# EAGLE design RPi_Extension_adc (EAGLE 8.4.3)
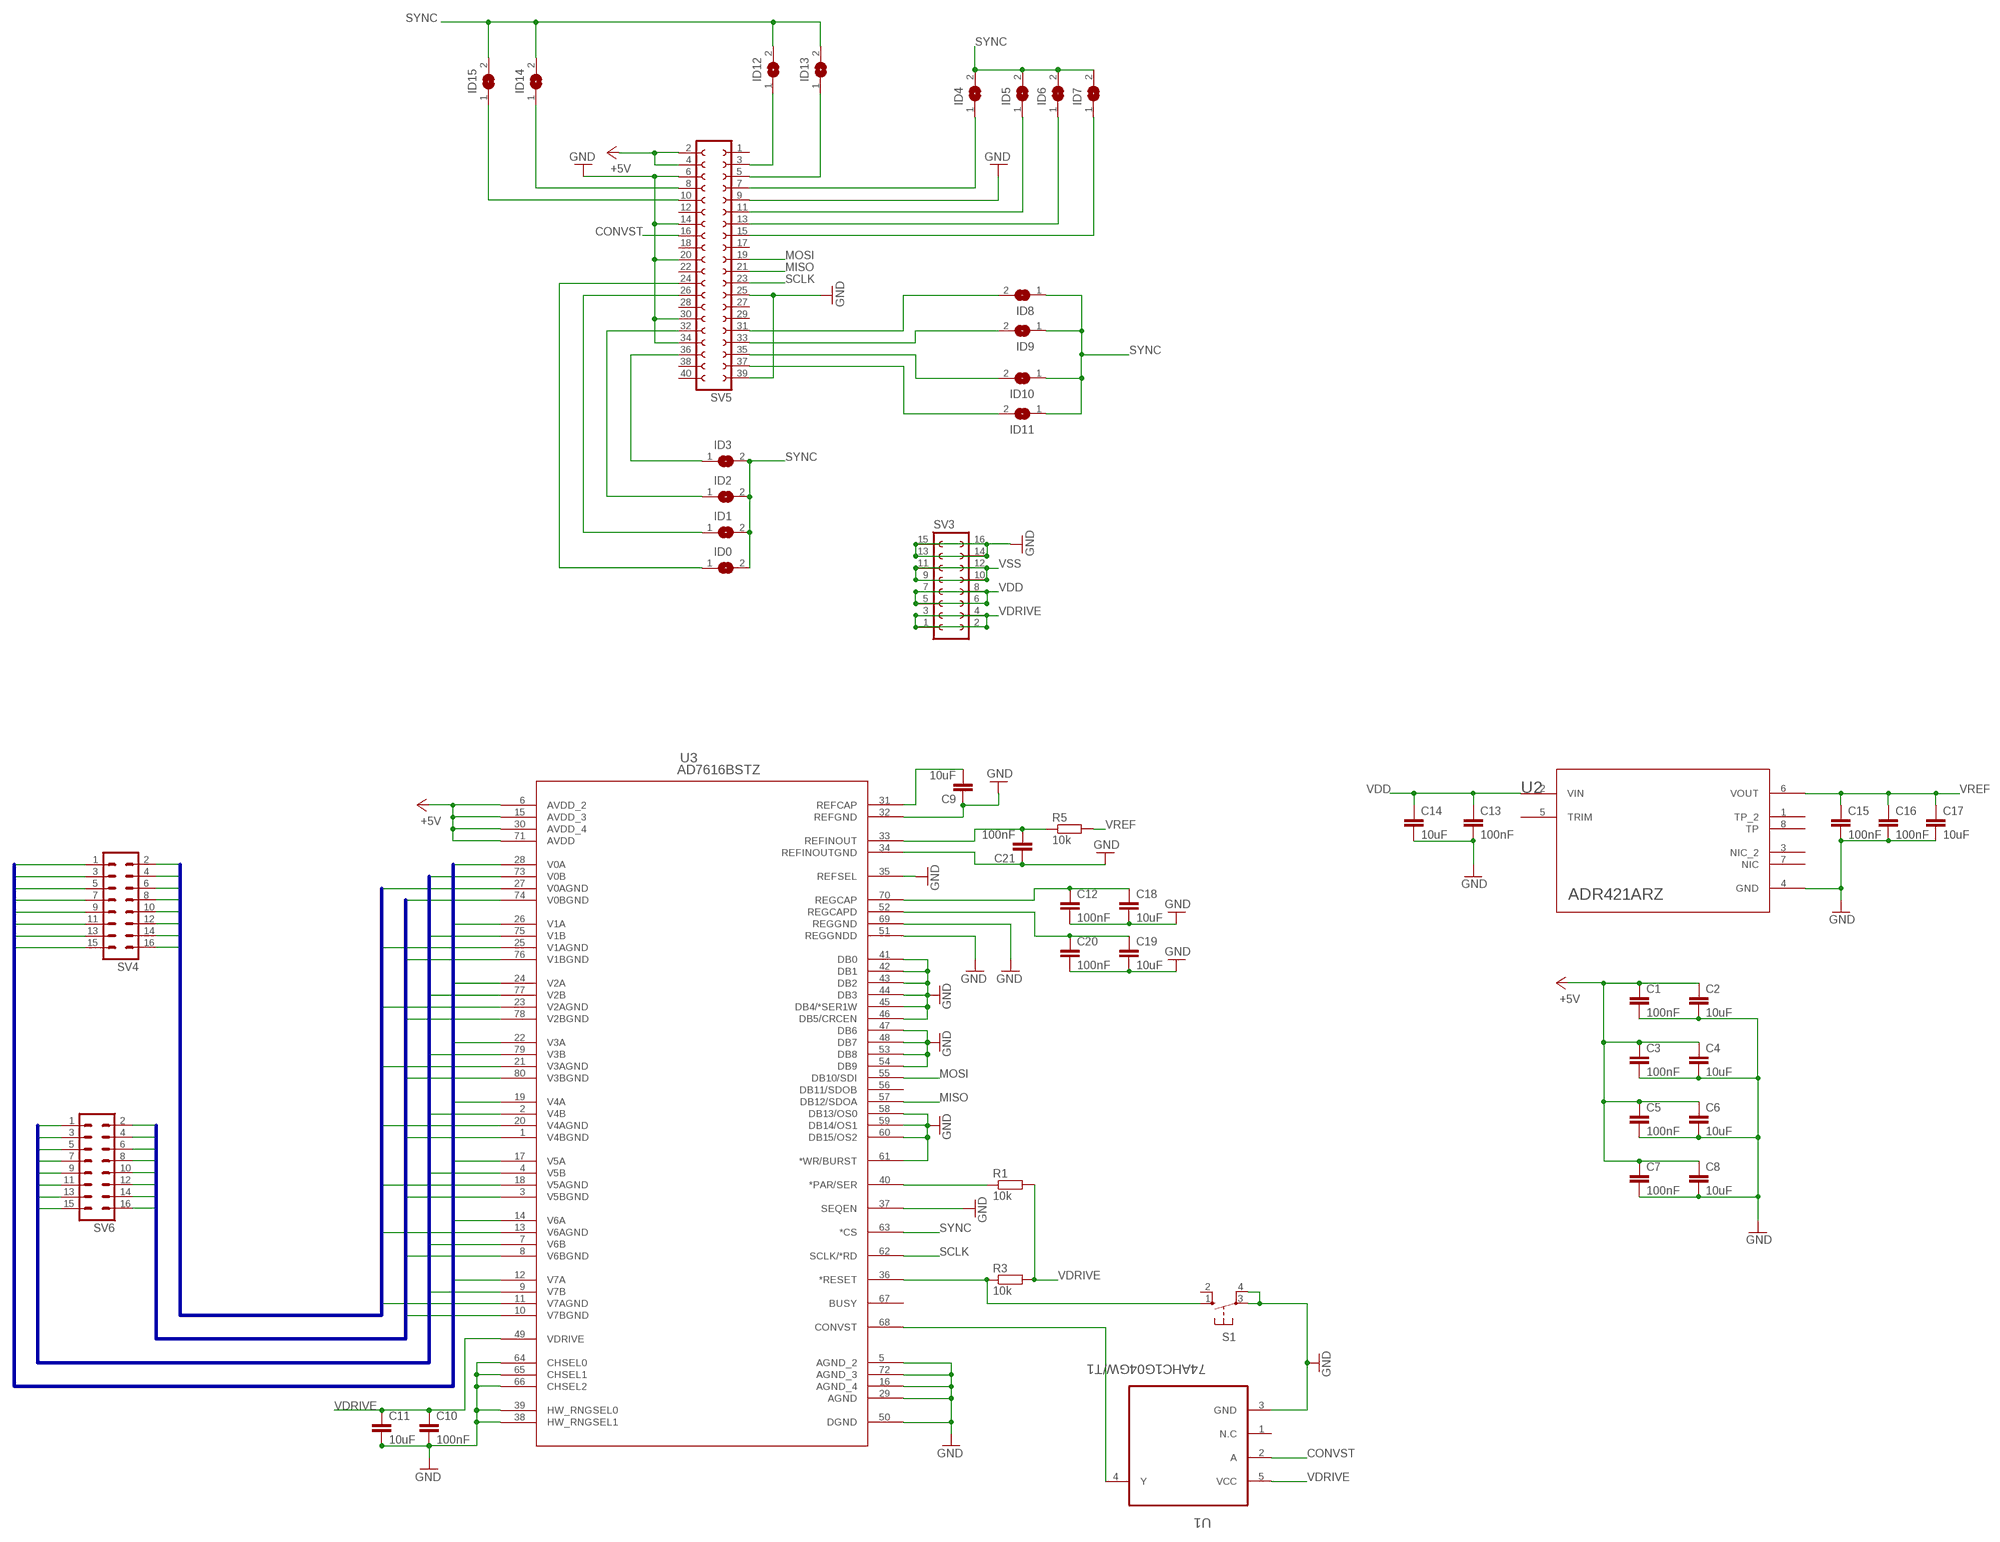
[diagram p0: schematic, sheet 1]

## Parts
C1  100nF  C-EUC0603  [C0603]
C2  10uF  C-EUC0603  [C0603]
C3  100nF  C-EUC0603  [C0603]
C4  10uF  C-EUC0603  [C0603]
C5  100nF  C-EUC0603  [C0603]
C6  10uF  C-EUC0603  [C0603]
C7  100nF  C-EUC0603  [C0603]
C8  10uF  C-EUC0603  [C0603]
C9  10uF  C-EUC0603  [C0603]
C10  100nF  C-EUC0603  [C0603]
C11  10uF  C-EUC0603  [C0603]
C12  100nF  C-EUC0603  [C0603]
C13  100nF  C-EUC0603  [C0603]
C14  10uF  C-EUC1206  [C1206]
C15  100nF  C-EUC0603  [C0603]
C16  100nF  C-EUC0603  [C0603]
C17  10uF  C-EUC1206  [C1206]
C18  10uF  C-EUC0603  [C0603]
C19  10uF  C-EUC0603  [C0603]
C20  100nF  C-EUC0603  [C0603]
C21  100nF  C-EUC0603  [C0603]
ID0  SJ  [SJ]
ID1  SJ  [SJ]
ID2  SJ  [SJ]
ID3  SJ  [SJ]
ID4  SJ  [SJ]
ID5  SJ  [SJ]
ID6  SJ  [SJ]
ID7  SJ  [SJ]
ID8  SJ  [SJ]
ID9  SJ  [SJ]
ID10  SJ  [SJ]
ID11  SJ  [SJ]
ID12  SJ  [SJ]
ID13  SJ  [SJ]
ID14  SJ  [SJ]
ID15  SJ  [SJ]
R1  10k  R-EU_R0603  [R0603]
R3  10k  R-EU_R0603  [R0603]
R5  10k  R-EU_R0603  [R0603]
S1  10-XX  [B3F-10XX]
SV3  FE08-2  [FE08-2]
SV4  MA08-2W  [MA08-2W]
SV5  FE20-2  [FE20-2]
SV6  MA08-2W  [MA08-2W]
U1  74AHC1G04GW/T1  [SOT65P210X110-5N]
U2  ADR421ARZ  ADR423ARZ  [R_8]
U3  AD7616BSTZ  [ST_80_2]

## Nets
+5V: C1.1 C2.1 C3.1 C4.1 C5.1 C6.1 C7.1 C8.1 SV5.2 SV5.4 U3.6(AVDD_2) U3.15(AVDD_3) U3.30(AVDD_4) U3.71(AVDD)
CONVST: SV5.16 U1.2(A)
GND: C1.2 C2.2 C3.2 C4.2 C5.2 C6.2 C7.2 C8.2 C9.1 C10.2 C11.2 C12.2 C13.2 C14.2 C15.2 C16.2 C17.2 C18.2 C19.2 C20.2 C21.1 S1.3(P) S1.4(P1) SV3.13 SV3.14 SV3.15 SV3.16 SV5.6 SV5.9 SV5.14 SV5.20 SV5.25 SV5.30 SV5.34 SV5.39 U1.3(GND) U2.4(GND) U3.5(AGND_2) U3.16(AGND_4) U3.29(AGND) U3.32(REFGND) U3.34(REFINOUTGND) U3.35(REFSEL) U3.37(SEQEN) U3.38(HW_RNGSEL1) U3.39(HW_RNGSEL0) U3.41(DB0) U3.42(DB1) U3.43(DB2) U3.44(DB3) U3.45(DB4/*SER1W) U3.46(DB5/CRCEN) U3.47(DB6) U3.48(DB7) U3.50(DGND) U3.51(REGGNDD) U3.53(DB8) U3.54(DB9) U3.58(DB13/OS0) U3.59(DB14/OS1) U3.60(DB15/OS2) U3.61(*WR/BURST) U3.64(CHSEL0) U3.65(CHSEL1) U3.66(CHSEL2) U3.69(REGGND) U3.72(AGND_3)
MISO: SV5.21 U3.57(DB12/SDOA)
MOSI: SV5.19 U3.55(DB10/SDI)
N$1: C12.1 C18.1 U3.70(REGCAP)
N$2: C9.2 U3.31(REFCAP)
N$3: U1.4(Y) U3.68(CONVST)
N$5: ID12.1 SV5.3
N$6: R1.1 U3.40(*PAR/SER)
N$7: R3.1 S1.1(S) U3.36(*RESET)
N$8: ID13.1 SV5.5
N$9: ID14.1 SV5.8
N$10: C21.2 R5.1 U3.33(REFINOUT)
N$11: ID15.1 SV5.10
N$12: ID8.2 SV5.31
N$13: ID9.2 SV5.33
N$14: ID10.2 SV5.35
N$15: ID11.2 SV5.37
N$16: C19.1 C20.1 U3.52(REGCAPD)
N$20: ID3.1 SV5.36
N$21: ID4.1 SV5.7
N$22: ID2.1 SV5.32
N$23: ID1.1 SV5.26
N$24: ID0.1 SV5.24
N$25: ID5.1 SV5.11
N$26: ID6.1 SV5.13
N$27: ID7.1 SV5.15
SCLK: SV5.23 U3.62(SCLK/*RD)
SYNC: ID0.2 ID1.2 ID2.2 ID3.2 ID4.2 ID5.2 ID6.2 ID7.2 ID8.1 ID9.1 ID10.1 ID11.1 ID12.2 ID13.2 ID14.2 ID15.2 U3.63(*CS)
VA_GND0: SV4.2 U3.27(V0AGND)
VA_GND1: SV4.4 U3.25(V1AGND)
VA_GND2: SV4.6 U3.23(V2AGND)
VA_GND3: SV4.8 U3.21(V3AGND)
VA_GND4: SV4.10 U3.20(V4AGND)
VA_GND5: SV4.12 U3.18(V5AGND)
VA_GND6: SV4.14 U3.13(V6AGND)
VA_GND7: SV4.16 U3.11(V7AGND)
VA_IN0: SV4.1 U3.28(V0A)
VA_IN1: SV4.3 U3.26(V1A)
VA_IN2: SV4.5 U3.24(V2A)
VA_IN3: SV4.7 U3.22(V3A)
VA_IN4: SV4.9 U3.19(V4A)
VA_IN5: SV4.11 U3.17(V5A)
VA_IN6: SV4.13 U3.14(V6A)
VA_IN7: SV4.15 U3.12(V7A)
VB_GND0: SV6.16 U3.74(V0BGND)
VB_GND1: SV6.14 U3.76(V1BGND)
VB_GND2: SV6.12 U3.78(V2BGND)
VB_GND3: SV6.10 U3.80(V3BGND)
VB_GND4: SV6.8 U3.1(V4BGND)
VB_GND5: SV6.6 U3.3(V5BGND)
VB_GND6: SV6.4 U3.8(V6BGND)
VB_GND7: SV6.2 U3.10(V7BGND)
VB_IN0: SV6.15 U3.73(V0B)
VB_IN1: SV6.13 U3.75(V1B)
VB_IN2: SV6.11 U3.77(V2B)
VB_IN3: SV6.9 U3.79(V3B)
VB_IN4: SV6.7 U3.2(V4B)
VB_IN5: SV6.5 U3.4(V5B)
VB_IN6: SV6.3 U3.7(V6B)
VB_IN7: SV6.1 U3.9(V7B)
VDD: C13.1 C14.1 SV3.5 SV3.6 SV3.7 SV3.8 U2.2(VIN)
VDRIVE: C10.1 C11.1 R1.2 R3.2 SV3.1 SV3.2 SV3.3 SV3.4 U1.5(VCC) U3.49(VDRIVE)
VREF: C15.1 C16.1 C17.1 R5.2 U2.6(VOUT)
VSS: SV3.9 SV3.10 SV3.11 SV3.12
Unconnected: S1.2(S1) SV5.1 SV5.12 SV5.17 SV5.18 SV5.22 SV5.27 SV5.28 SV5.29 SV5.38 SV5.40 U1.1(N.C) U2.1(TP_2) U2.3(NIC_2) U2.5(TRIM) U2.7(NIC) U2.8(TP) U3.56(DB11/SDOB) U3.67(BUSY)

## Buses
VA_GND[0..7]
VA_IN[0..7]
VB_IN[0..7]
VB_GND[0..7]

## Library data of the parts
C1-C21 = rcl:C-EU: CAPACITOR, European symbol
ID0 ID1-ID15 = jumper:SJ: SMD solder JUMPER
R1 R3 R5 = resistor:R-EU_: RESISTOR, European symbol
S1 = switch-omron:10-XX: OMRON SWITCH; MPN: B3F-1000; OC_FARNELL: 176432; OC_NEWARK: 36M3542
SV3 = con-lsta:FE08-2: FEMALE HEADER; OC_FARNELL: unknown; OC_NEWARK: unknown
SV4 SV6 = con-lstb:MA08-2W: PIN HEADER; OC_FARNELL: unknown; OC_NEWARK: unknown
SV5 = con-lsta:FE20-2: FEMALE HEADER; OC_FARNELL: unknown; OC_NEWARK: unknown
U1 = 74AHC1G04GW:74AHC1G04GW/T1: Inverter; MPN: 74AHC1G04GW/T1; OC_FARNELL: 1085239; OC_NEWARK: 99K0513; PACKAGE: SOT353-1-5; SUPPLIER: NXP
U2 = ADR423ARZ:ADR423ARZ; MANUFACTURER_PART_NUMBER: ADR423ARZ; VENDOR: Vendor
U3 = AD7616BSTZ:AD7616BSTZ

## Board
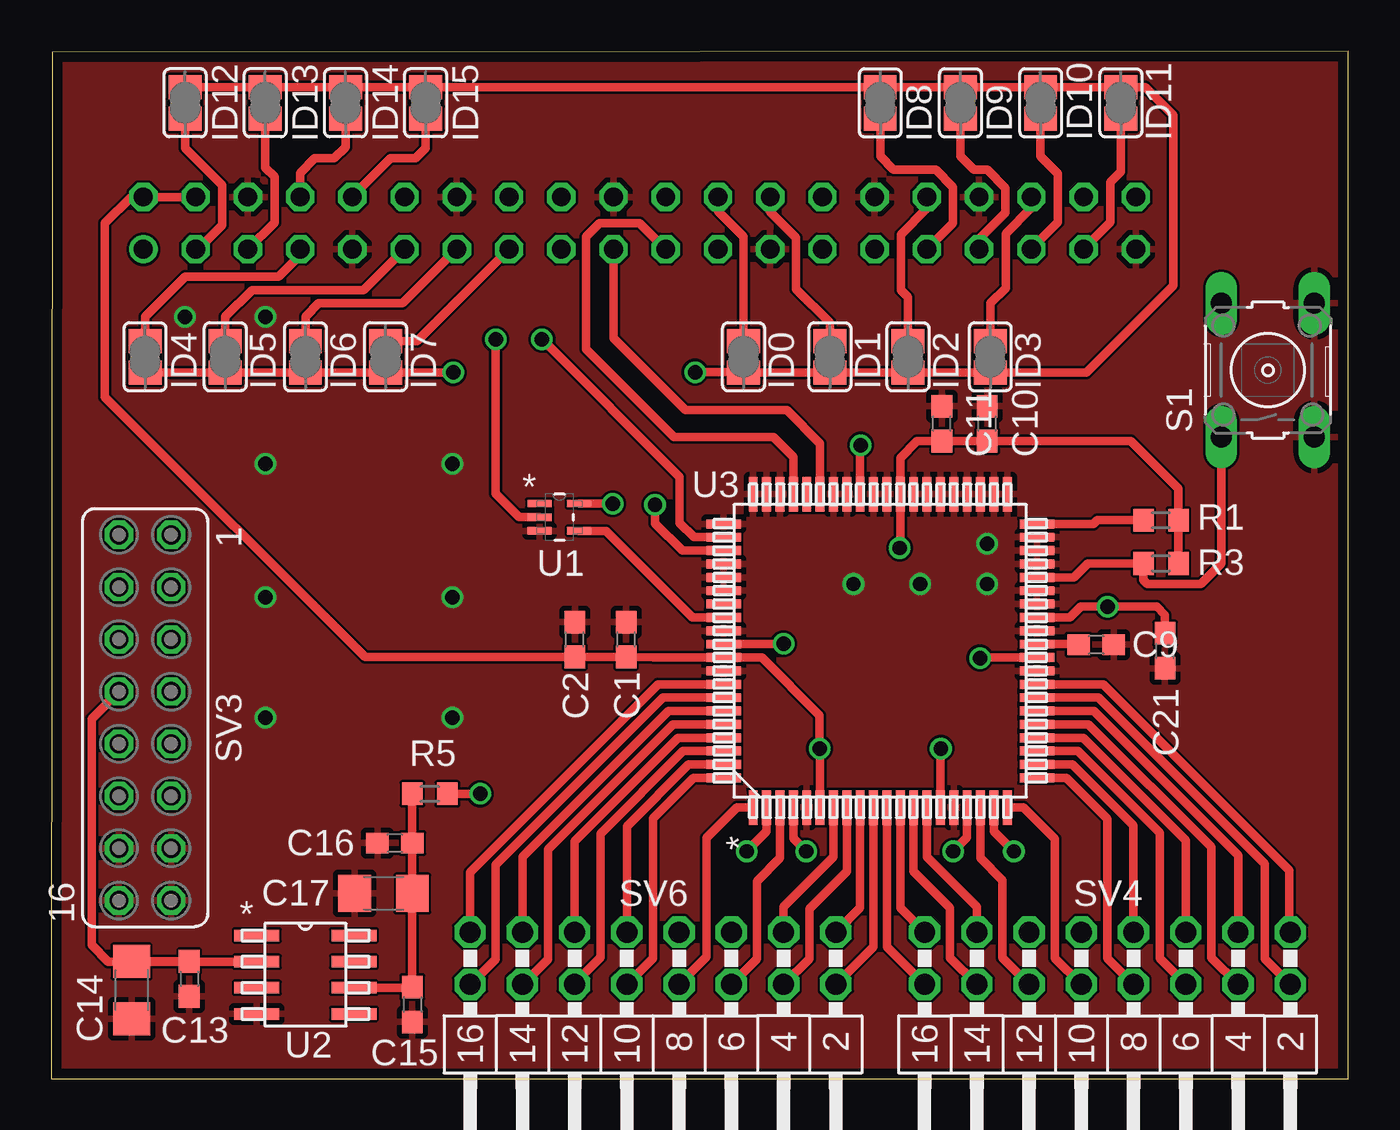
[diagram p1: board, top side]
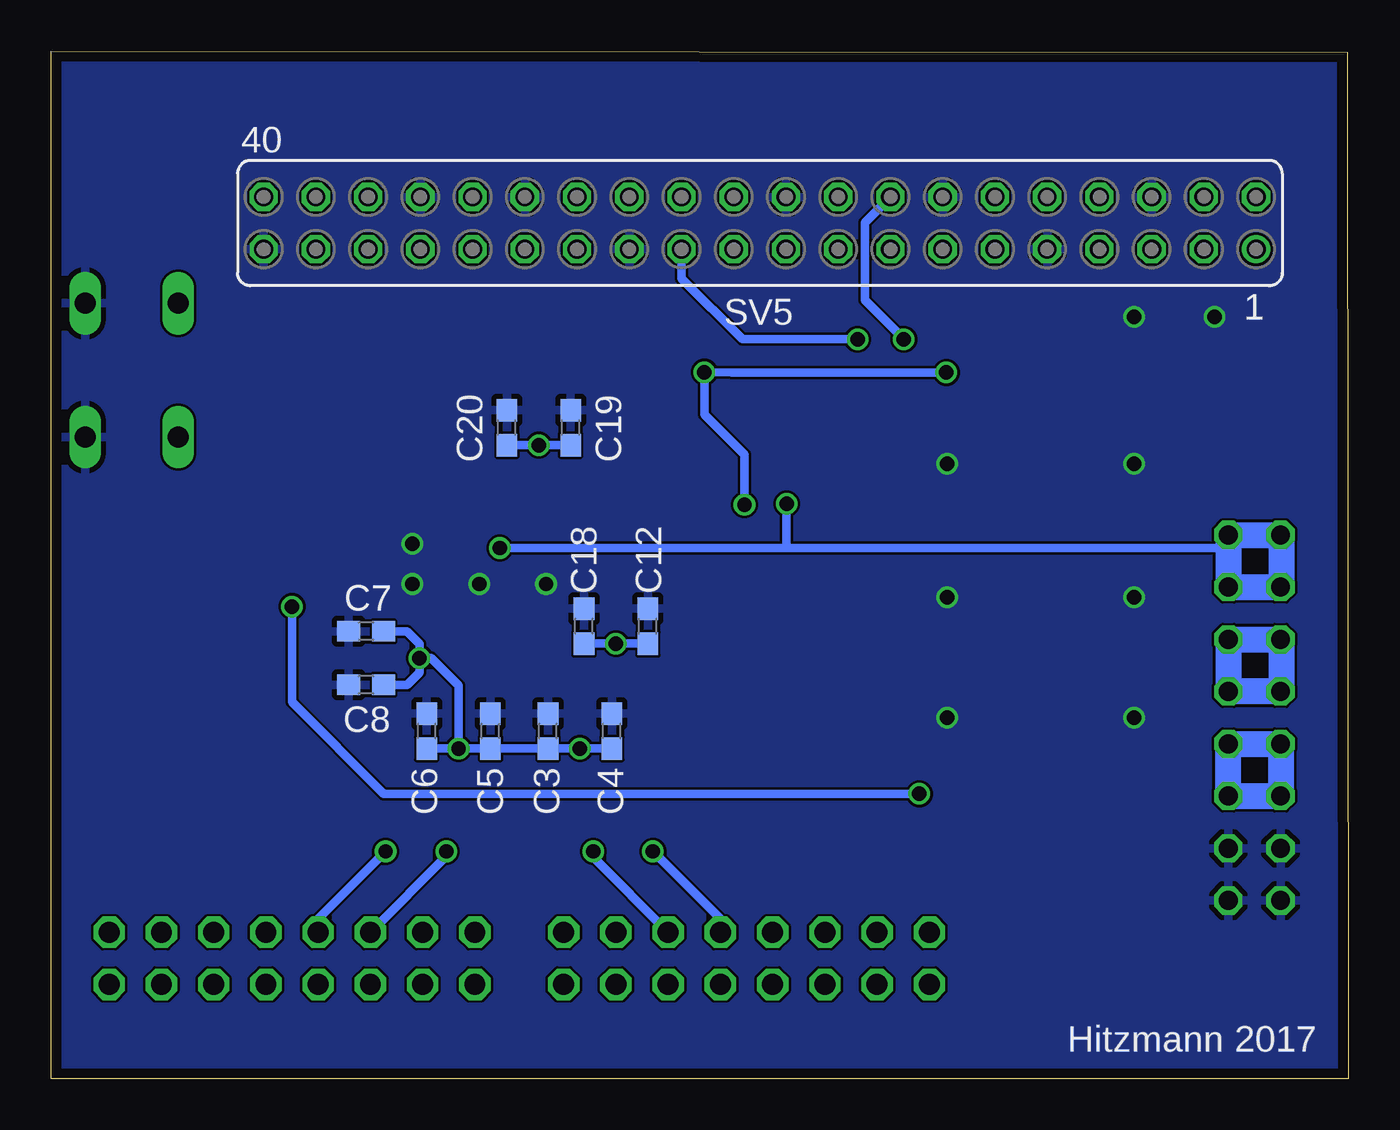
[diagram p2: board, bottom side, seen from below]

Size 63.05 x 49.95 mm. Coordinates in mm from the lower left corner, seen from the top.
Outline: 0,0 63.05,0 63.05,49.95 0.05,49.9 0,0
Copper layers (1*16): Top 0.035mm / dielectric 1.53mm / Bottom 0.035mm
Design rules "pban_5mil-l2": minimum track width 5mil, minimum drill 0.3mm, track to track 5mil, track to pad 0.229mm, pad to pad 5mil, via to via 5mil, smd to smd 5mil, copper to edge 0.5mm, drill to drill 0.5mm, minimum pad ring 0.15mm, minimum via ring 0.15mm, stop-mask expansion 4mil, vias tented up to drill 0.35mm, thermal gap 10mil

### Footprints (pad centres in the part's own frame; a part is rotated, then mirrored left to right if it is on the bottom)
C0603 = smd 1.1 x 1: 1 -0.85,0; 2 0.85,0
C1206 = smd 1.6 x 1.8: 1 -1.4,0; 2 1.4,0
SJ = smd 1.168 x 1.6: 1 -0.762,0; 2 0.762,0
R0603 = smd 1 x 1.1: 1 -0.85,0; 2 0.85,0
B3F-10XX = drill 1.016 long: 1 -3.251,2.261; 2 3.251,2.261; 3 -3.251,-2.261; 4 3.251,-2.261
FE08-2 = drill 0.914 octagon: 1 -8.89,1.27; 2 -8.89,-1.27; 3 -6.35,1.27; 4 -6.35,-1.27; 5 -3.81,1.27; 6 -3.81,-1.27; 7 -1.27,1.27; 8 -1.27,-1.27; 9 1.27,1.27; 10 1.27,-1.27; 11 3.81,1.27; 12 3.81,-1.27; 13 6.35,1.27; 14 6.35,-1.27; 15 8.89,1.27; 16 8.89,-1.27
MA08-2W = drill 1.016 octagon: 1 -8.89,-1.27; 2 -8.89,1.27; 3 -6.35,-1.27; 4 -6.35,1.27; 5 -3.81,-1.27; 6 -3.81,1.27; 7 -1.27,-1.27; 8 -1.27,1.27; 9 1.27,-1.27; 10 1.27,1.27; 11 3.81,-1.27; 12 3.81,1.27; 13 6.35,-1.27; 14 6.35,1.27; 15 8.89,-1.27; 16 8.89,1.27
FE20-2 = drill 0.914: 1 -24.13,1.27 | drill 0.914 octagon: 2 -24.13,-1.27; 3 -21.59,1.27; 4 -21.59,-1.27; 5 -19.05,1.27; 6 -19.05,-1.27; 7 -16.51,1.27; 8 -16.51,-1.27; 9 -13.97,1.27; 10 -13.97,-1.27; 11 -11.43,1.27; 12 -11.43,-1.27; 13 -8.89,1.27; 14 -8.89,-1.27; 15 -6.35,1.27; 16 -6.35,-1.27; 17 -3.81,1.27; 18 -3.81,-1.27; 19 -1.27,1.27; 20 -1.27,-1.27; 21 1.27,1.27; 22 1.27,-1.27; 23 3.81,1.27; 24 3.81,-1.27; 25 6.35,1.27; 26 6.35,-1.27; 27 8.89,1.27; 28 8.89,-1.27; 29 11.43,1.27; 30 11.43,-1.27; 31 13.97,1.27; 32 13.97,-1.27; 33 16.51,1.27; 34 16.51,-1.27; 35 19.05,1.27; 36 19.05,-1.27; 37 21.59,1.27; 38 21.59,-1.27; 39 24.13,1.27; 40 24.13,-1.27
SOT65P210X110-5N = smd 1.168 x 0.356: 1 -0.965,0.66; 2 -0.965,0; 3 -0.965,-0.66; 4 0.965,-0.66; 5 0.965,0.66
R_8 = smd 2.184 x 0.559: 1 -2.362,1.905; 2 -2.362,0.635; 3 -2.362,-0.635; 4 -2.362,-1.905; 5 2.362,-1.905; 6 2.362,-0.635; 7 2.362,0.635; 8 2.362,1.905
ST_80_2 = smd 1.676 x 0.432: 1 -7.62,6.175; 2 -7.62,5.525; 3 -7.62,4.875; 4 -7.62,4.225; 5 -7.62,3.575; 6 -7.62,2.925; 7 -7.62,2.275; 8 -7.62,1.625; 9 -7.62,0.975; 10 -7.62,0.325; 11 -7.62,-0.325; 12 -7.62,-0.975; 13 -7.62,-1.625; 14 -7.62,-2.275; 15 -7.62,-2.925; 16 -7.62,-3.575; 17 -7.62,-4.225; 18 -7.62,-4.875; 19 -7.62,-5.525; 20 -7.62,-6.175; 41 7.62,-6.175; 42 7.62,-5.525; 43 7.62,-4.875; 44 7.62,-4.225; 45 7.62,-3.575; 46 7.62,-2.925; 47 7.62,-2.275; 48 7.62,-1.625; 49 7.62,-0.975; 50 7.62,-0.325; 51 7.62,0.325; 52 7.62,0.975; 53 7.62,1.625; 54 7.62,2.275; 55 7.62,2.925; 56 7.62,3.575; 57 7.62,4.225; 58 7.62,4.875; 59 7.62,5.525; 60 7.62,6.175 | smd 0.432 x 1.676: 21 -6.175,-7.62; 22 -5.525,-7.62; 23 -4.875,-7.62; 24 -4.225,-7.62; 25 -3.575,-7.62; 26 -2.925,-7.62; 27 -2.275,-7.62; 28 -1.625,-7.62; 29 -0.975,-7.62; 30 -0.325,-7.62; 31 0.325,-7.62; 32 0.975,-7.62; 33 1.625,-7.62; 34 2.275,-7.62; 35 2.925,-7.62; 36 3.575,-7.62; 37 4.225,-7.62; 38 4.875,-7.62; 39 5.525,-7.62; 40 6.175,-7.62; 61 6.175,7.62; 62 5.525,7.62; 63 4.875,7.62; 64 4.225,7.62; 65 3.575,7.62; 66 2.925,7.62; 67 2.275,7.62; 68 1.625,7.62; 69 0.975,7.62; 70 0.325,7.62; 71 -0.325,7.62; 72 -0.975,7.62; 73 -1.625,7.62; 74 -2.275,7.62; 75 -2.925,7.62; 76 -3.575,7.62; 77 -4.225,7.62; 78 -4.875,7.62; 79 -5.525,7.62; 80 -6.175,7.62

### Placement (x,y rotation side)
C1  27.95,21.35 90 top
C2  25.45,21.35 90 top
C3  38.9,16.9 90 bottom
C4  35.8,16.9 90 bottom
C5  41.7,16.9 90 bottom
C6  44.8,16.9 90 bottom
C7  47.75,21.75 180 bottom
C8  47.75,19.15 180 bottom
C9  50.8,21.1 180 top
C10  45.5,31.85 90 top
C11  43.3,31.85 90 top
C12  34.05,22 90 bottom
C13  6.7,4.85 270 top
C14  3.9,4.3 270 top
C15  17.55,3.6 270 top
C16  16.7,11.45 180 top
C17  16.15,9 180 top
C18  37.15,22 90 bottom
C19  37.8,31.65 90 bottom
C20  40.9,31.65 90 bottom
C21  54.15,20.8 90 top
ID0  33.65,35.1 270 top
ID1  37.85,35.1 270 top
ID2  41.65,35.1 270 top
ID3  45.65,35.1 270 top
ID4  4.55,35.1 270 top
ID5  8.45,35.1 270 top
ID6  12.35,35.1 270 top
ID7  16.25,35.1 270 top
ID8  40.3,47.45 270 top
ID9  44.2,47.45 270 top
ID10  48.1,47.45 270 top
ID11  52,47.45 270 top
ID12  6.5,47.45 90 top
ID13  10.4,47.45 90 top
ID14  14.3,47.45 90 top
ID15  18.2,47.45 90 top
R1  53.95,27.15 0 top
R3  53.95,25.05 0 top
R5  18.4,13.85 180 top
S1  59.15,34.45 90 top
SV3  4.55,17.55 270 top
SV4  51.35,5.85 180 top
SV5  28.6,41.6 180 bottom
SV6  29.25,5.85 180 top
U1  24.7,27.3 0 top
U2  12.35,5.05 0 top
U3  40.3,20.8 90 top

### Tracks (layer width: path | path; a pad name or v marks a point on that pad's centre or on a via)
+5V  (via drill 0.7)
  Top 0.406: U3.15 43.23,16.02 v43.25,16.05 | U3.30 45.17,20.48 v45.15,20.45 | SV5.4 SV5.2 3.87,42.87 2.6,41.6 2.6,33.15 15.25,20.5 C2.1 C1.1 29.27,20.48 U3.71 34.55,20.48 37.35,17.67 v37.35,16.05 37.38,16.02 U3.6
  Bottom 0.406: v43.25,16.05 C5.1 C3.1 v37.35,16.05 C4.1 | C6.1 v43.25,16.05 | v45.15,20.45 44.59,20.45 43.25,19.11 v43.25,16.05 | C8.1 45.75,19.15 45.15,19.75 v45.15,20.45 | C7.1 45.76,21.75 45.15,21.14 v45.15,20.45
CONVST  (via drill 0.7)
  Top 0.406: v21.6,35.95 21.6,28.45 22.75,27.3 U1.2
  Bottom 0.406: v21.6,35.95 23.5,37.85 23.5,41.62 SV5.16
GND  (via drill 0.7)
  other vias: 6.5,37.05 10.4,37.05 45.5,24.05 45.5,26 39,24.05 42.25,24.05 19.5,29.9 19.5,23.4 19.5,17.55 10.4,29.9 10.4,23.4 10.4,17.55
  pour Top: -0.65,-0.65 63.7,-0.65 63.7,50.7 -0.65,50.7
  pour Bottom: 0,0 0,50.05 63.05,50.05 63.05,0
MISO
  Top 0.406: SV5.21 28.6,41.6 26.65,41.6 26,40.95 26,35.48 30.28,31.2 35.1,31.2 36.08,30.23 U3.57
MOSI
  Top 0.406: SV5.19 27.33,36 30.83,32.5 35.76,32.5 37.38,30.88 U3.55
N$1  (via drill 0.7)
  Top 0.406: U3.70 35.58,21.12 v35.6,21.15
  Bottom 0.406: C18.1 v35.6,21.15 C12.1
N$2
  Top 0.406: U3.31 49.95,21.12 C9.2
N$3
  Top 0.406: U3.68 31.18,22.43 30.55,23.05 26.96,26.64 U1.4
N$5
  Top 0.406: SV5.3 7.13,40.33 8.3,41.5 8.3,43.45 6.5,45.25 ID12.1
N$6
  Top 0.406: R1.1 50.85,27.15 50.67,26.98 U3.40
N$7
  Top 0.406: U3.36 49.73,24.38 50.4,25.05 R3.1 53.1,24.25 53.3,24.05 55.9,24.05 56.89,25.04 S1.1
N$8
  Top 0.406: ID13.1 10.4,44.3 10.85,43.85 10.85,41.63 SV5.5
N$9
  Top 0.406: SV5.8 12.09,44.04 12.8,44.75 13.75,44.75 14.3,45.3 ID14.1
N$10  (via drill 0.7)
  Top 0.406: R5.1 v20.85,13.85 | U3.33 49.52,22.43 50.05,22.95 v51.35,22.95 53.75,22.95 54.15,22.55 C21.2
  Bottom 0.406: v20.85,13.85 46.89,13.85 51.35,18.31 v51.35,22.95
N$11
  Top 0.406: SV5.10 16.5,44.75 17.7,44.75 18.2,45.25 ID15.1
N$12
  Top 0.406: SV5.31 43.84,41.59 43.84,43.36 43,44.2 40.95,44.2 40.3,44.85 ID8.2
N$13
  Top 0.406: SV5.33 45.11,40.81 46.4,42.1 46.4,43.3 45.5,44.2 44.85,44.2 44.2,44.85 ID9.2
N$14
  Top 0.406: SV5.35 47.65,40.35 48.95,41.65 48.95,44 48.1,44.85 ID10.2
N$15
  Top 0.406: ID11.2 52,44.1 51.5,43.6 51.5,41.64 SV5.37
N$16  (via drill 0.7)
  Top 0.406: U3.52 39.33,30.77 v39.35,30.8
  Bottom 0.406: C20.1 v39.35,30.8 C19.1
N$20
  Top 0.406: SV5.36 47.65,42.35 46.4,41.1 46.4,38.45 45.65,37.7 ID3.1
N$21
  Top 0.406: SV5.7 12.09,40.04 11.05,39 6.5,39 4.55,37.05 ID4.1
N$22
  Top 0.406: SV5.32 42.57,42.32 41.3,41.05 41.3,38.35 41.65,38 ID2.1 41.75,36.25
N$23
  Top 0.406: SV5.26 34.95,42.15 36.2,40.9 36.2,38.4 37.85,36.75 ID1.1
N$24
  Top 0.406: SV5.24 32.41,42.19 33.65,40.95 ID0.1
N$25
  Top 0.406: ID5.1 8.45,37.05 9.75,38.35 15.19,38.35 SV5.11
N$26
  Top 0.406: ID6.1 12.35,37.05 13,37.7 17.08,37.7 SV5.13
N$27
  Top 0.406: ID7.1 17.78,35.86 SV5.15
SCLK  (via drill 0.7)
  Top 0.406: U3.62 31.24,26.32 30.55,27.02 30.55,29.25 v23.85,35.95
  Bottom 0.406: SV5.23 32.41,38.91 29.45,35.95 v23.85,35.95
SYNC  (via drill 0.7)
  Top 0.406: ID4.2 ID5.2 ID6.2 ID7.2 v19.54,34.34 | v31.3,34.35 33.64,34.35 ID0.2 ID1.2 ID2.2 ID3.2 50.33,34.34 54.55,38.55 54.55,46.85 53.19,48.21 ID11.1 ID10.1 ID9.1 ID8.1 ID15.2 ID14.2 ID13.2 ID12.2 | v29.35,27.9 29.35,27 30.68,25.68 U3.63
  Bottom 0.406: v19.54,34.34 29.99,34.34 v31.3,34.35 31.3,32.3 29.35,30.35 v29.35,27.9
VA_GND0
  Top 0.406: U3.27 50.92,18.52 59,10.44 59,5.82 SV4.2
VA_GND1
  Top 0.406: U3.25 50.43,17.23 56.4,11.26 56.4,5.88 SV4.4
VA_GND2
  Top 0.406: U3.23 49.91,15.93 53.9,11.94 53.9,5.84 SV4.6
VA_GND3
  Top 0.406: SV4.8 51.35,5.85 51.35,12.62 49.34,14.62 U3.21
VA_GND4
  Top 0.406: U3.20 47.27,13.18 48.8,11.65 48.8,5.86 SV4.10
VA_GND5
  Top 0.406: U3.18 45.17,10.72 46.25,9.65 46.25,5.87 SV4.12
VA_GND6
  Top 0.406: U3.13 41.92,10.07 43.7,8.3 43.7,5.88 SV4.14
VA_GND7
  Top 0.406: SV4.16 41.72,5.32 40.95,6.09 40.62,6.42 U3.11
VA_IN0
  Top 0.406: U3.28 51.16,19.18 60.2,10.13 60.2,7.16 SV4.1
VA_IN1
  Top 0.406: U3.26 50.68,17.88 57.7,10.86 SV4.3
VA_IN2
  Top 0.406: U3.24 50.17,16.57 55.15,11.59 SV4.5
VA_IN3
  Top 0.406: U3.22 49.65,15.28 52.6,12.32 52.6,7.14 SV4.7
VA_IN4  (via drill 0.7)
  Top 0.406: U3.19 45.83,12.03 v46.8,11.05
  Bottom 0.406: v46.8,11.05 50.05,7.8 50.05,7.15 SV4.9
VA_IN5  (via drill 0.7)
  Top 0.406: U3.17 44.52,11.72 v43.85,11.05
  Bottom 0.406: v43.85,11.05 43.85,10.81 SV4.11
VA_IN6
  Top 0.406: U3.14 42.58,10.78 45,8.35 SV4.13
VA_IN7
  Top 0.406: U3.12 41.27,8.3 SV4.15
VB_GND0
  Top 0.406: U3.74 29.73,18.52 21.6,10.4 21.6,5.8 20.38,4.58 SV6.16
VB_GND1
  Top 0.406: U3.76 30.22,17.23 24.15,11.15 24.15,5.8 22.93,4.58 SV6.14
VB_GND2
  Top 0.406: U3.78 30.72,15.93 26.7,11.91 26.7,5.9 25.44,4.64 SV6.12
VB_GND3
  Top 0.406: U3.80 31.21,14.62 29.25,12.66 29.25,5.85 SV6.10
VB_GND4
  Top 0.406: U3.1 33.33,13.18 31.85,11.7 31.85,5.91 SV6.8
VB_GND5
  Top 0.406: U3.3 35.42,10.72 34.3,9.6 34.3,5.82 SV6.6
VB_GND6
  Top 0.406: U3.8 38.67,10.07 36.85,8.25 36.85,5.83 SV6.4
VB_GND7
  Top 0.406: U3.10 39.98,6.42 SV6.2
VB_IN0
  Top 0.406: SV6.15 20.36,10.04 29.5,19.18 U3.73
VB_IN1
  Top 0.406: SV6.13 22.9,10.78 30,17.88 U3.75
VB_IN2
  Top 0.406: SV6.11 25.44,11.54 30.48,16.57 U3.77
VB_IN3
  Top 0.406: SV6.9 27.98,12.27 30.98,15.28 U3.79
VB_IN4  (via drill 0.7)
  Top 0.406: U3.2 34.77,12.03 v33.8,11.05
  Bottom 0.406: v33.8,11.05 30.55,7.8 30.55,7.15 SV6.7
VB_IN5  (via drill 0.7)
  Top 0.406: U3.4 36.08,11.68 v36.7,11.05
  Bottom 0.406: v36.7,11.05 36.7,10.76 SV6.5
VB_IN6
  Top 0.406: U3.7 38.02,10.78 35.6,8.35 SV6.3
VB_IN7
  Top 0.406: U3.9 39.33,8.3 SV6.1
VDD
  Top 0.406: SV3.5 | C14.1 C13.1 6.71,5.68 U2.2 2.77,5.68 1.95,6.5 1.95,17.49 SV3.8
  Bottom 0.406: SV3.6 SV3.5
  Bottom 1.27: SV3.8 SV3.7 SV3.5 3.25,21.36 3.25,18.85
VDRIVE  (via drill 0.7)
  Top 0.406: U3.49 | R3.2 R1.2 54.8,28.7 52.49,31 C10.1 C11.1 42.09,31 41.27,30.18 U3.49 | U3.49 41.27,25.82 v41.25,25.8 | U1.5 v27.29,27.96 v27.3,27.95
  Bottom 0.406: SV3.2 SV3.1 | 5.82,25.35 6.27,25.8 27.3,25.8 | v41.25,25.8 27.3,25.8 | v27.3,27.95 27.3,25.8
  Bottom 1.27: SV3.4 SV3.3 5.82,25.35 SV3.1 3.25,26.44 3.25,24.05
VREF
  Top 0.406: U2.6 17.52,4.42 C15.1 C17.1 C16.1 R5.2
VSS
  Top 0.406: 5.82,16.3 SV3.9
  Bottom 0.406: SV3.9 5.85,16.28 | 5.82,13.65 SV3.11
  Bottom 1.27: SV3.9 SV3.10 SV3.12 SV3.11 | 5.85,16.28 5.85,13.75

### Text on the board
bNames: Hitzmann 2017